# Altium schematic sheet RAM_DDR3_D16bit_BGA96.SchDoc
size A3
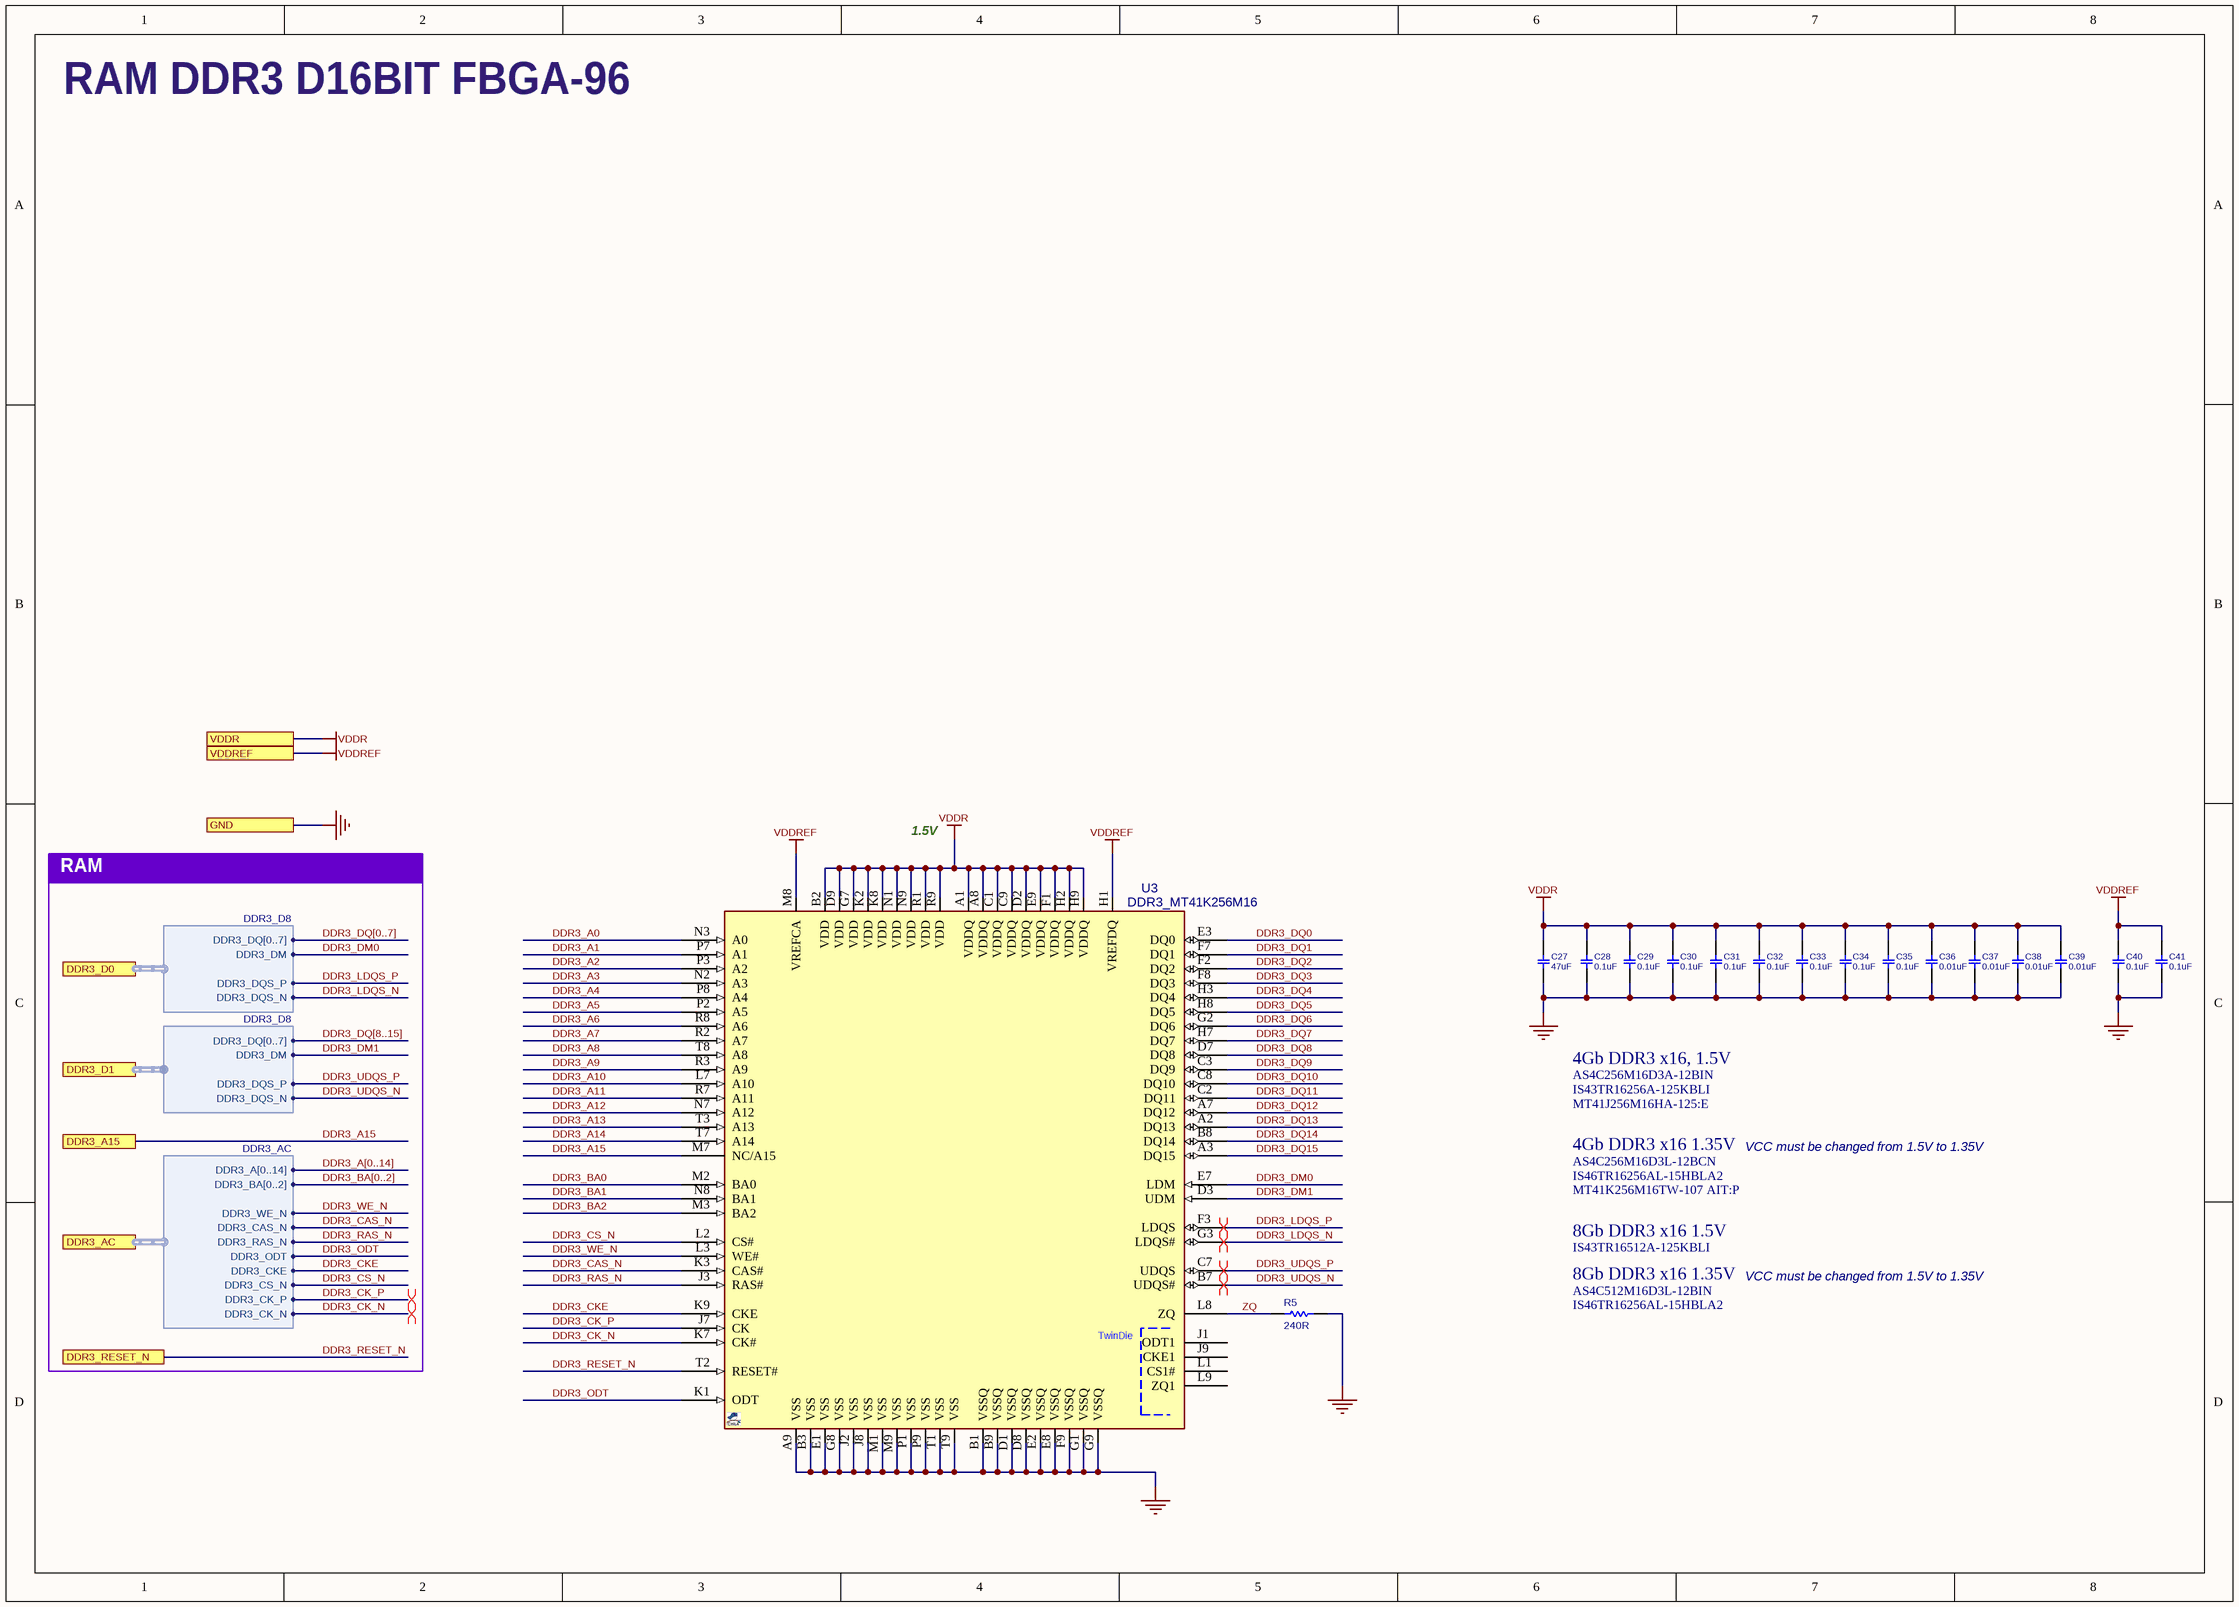
[diagram p0: RAM_DDR3_D16bit_BGA96.SchDoc]

## Parts
C27  47uF  [C0805]
C28  0.1uF  [C0402A]
C29  0.1uF  [C0402A]
C30  0.1uF  [C0402A]
C31  0.1uF  [C0402A]
C32  0.1uF  [C0402A]
C33  0.1uF  [C0402A]
C34  0.1uF  [C0402A]
C35  0.1uF  [C0402A]
C36  0.01uF  [C0402A]
C37  0.01uF  [C0402A]
C38  0.01uF  [C0402A]
C39  0.01uF  [C0402A]
C40  0.1uF  [C0402A]
C41  0.1uF  [C0402A]
R5  240R  [R0402A]
U3  DDR3_MT41K256M16  [BGA80_96_9X16B]

## Ports
DDR3_A15, DDR3_AC (harness DDR3_AC), DDR3_D0 (harness DDR3_D8), DDR3_D1 (harness DDR3_D8), DDR3_RESET_N, GND, VDDR, VDDREF

## Harnesses
DDR3_D8: DDR3_DQ[0..7], DDR3_DM, DDR3_DQS_P, DDR3_DQS_N
DDR3_AC: DDR3_A[0..14], DDR3_BA[0..2], DDR3_WE_N, DDR3_CAS_N, DDR3_RAS_N, DDR3_ODT, DDR3_CKE, DDR3_CS_N, DDR3_CK_P, DDR3_CK_N

## Nets
GND: C27.1 C28.1 C29.1 C30.1 C31.1 C32.1 C33.1 C34.1 C35.1 C36.1 C37.1 C38.1 C39.1 C40.1 C41.1 R5.2 U3.A9(VSS) U3.B1(VSSQ) U3.B3(VSS) U3.B9(VSSQ) U3.D1(VSSQ) U3.D8(VSSQ) U3.E1(VSS) U3.E2(VSSQ) U3.E8(VSSQ) U3.F9(VSSQ) U3.G1(VSSQ) U3.G8(VSS) U3.G9(VSSQ) U3.J2(VSS) U3.J8(VSS) U3.M1(VSS) U3.M9(VSS) U3.P1(VSS) U3.P9(VSS) U3.T1(VSS) U3.T9(VSS) ; port GND
VDDR: C27.2 C28.2 C29.2 C30.2 C31.2 C32.2 C33.2 C34.2 C35.2 C36.2 C37.2 C38.2 C39.2 U3.A1(VDDQ) U3.A8(VDDQ) U3.B2(VDD) U3.C1(VDDQ) U3.C9(VDDQ) U3.D2(VDDQ) U3.D9(VDD) U3.E9(VDDQ) U3.F1(VDDQ) U3.G7(VDD) U3.H2(VDDQ) U3.H9(VDDQ) U3.K2(VDD) U3.K8(VDD) U3.N1(VDD) U3.N9(VDD) U3.R1(VDD) U3.R9(VDD) ; port VDDR
VDDREF: C40.2 C41.2 U3.H1(VREFDQ) U3.M8(VREFCA) ; port VDDREF
DDR3_A0: U3.N3(A0)
DDR3_A1: U3.P7(A1)
DDR3_A2: U3.P3(A2)
DDR3_A3: U3.N2(A3)
DDR3_A4: U3.P8(A4)
DDR3_A5: U3.P2(A5)
DDR3_A6: U3.R8(A6)
DDR3_A7: U3.R2(A7)
DDR3_A8: U3.T8(A8)
DDR3_A9: U3.R3(A9)
DDR3_A10: U3.L7(A10)
DDR3_A11: U3.R7(A11)
DDR3_A12: U3.N7(A12)
DDR3_A13: U3.T3(A13)
DDR3_A14: U3.T7(A14)
DDR3_A15: U3.M7(NC/A15) ; port DDR3_A15
DDR3_BA0: U3.M2(BA0)
DDR3_BA1: U3.N8(BA1)
DDR3_BA2: U3.M3(BA2)
DDR3_CAS_N: U3.K3(CAS#) ; port DDR3_AC.DDR3_CAS_N
DDR3_CK_N: U3.K7(CK#) ; port DDR3_AC.DDR3_CK_N
DDR3_CK_P: U3.J7(CK) ; port DDR3_AC.DDR3_CK_P
DDR3_CKE: U3.K9(CKE) ; port DDR3_AC.DDR3_CKE
DDR3_CS_N: U3.L2(CS#) ; port DDR3_AC.DDR3_CS_N
DDR3_DM0: U3.E7(LDM) ; port DDR3_D0.DDR3_DM
DDR3_DM1: U3.D3(UDM) ; port DDR3_D1.DDR3_DM
DDR3_DQ0: U3.E3(DQ0)
DDR3_DQ1: U3.F7(DQ1)
DDR3_DQ2: U3.F2(DQ2)
DDR3_DQ3: U3.F8(DQ3)
DDR3_DQ4: U3.H3(DQ4)
DDR3_DQ5: U3.H8(DQ5)
DDR3_DQ6: U3.G2(DQ6)
DDR3_DQ7: U3.H7(DQ7)
DDR3_DQ8: U3.D7(DQ8)
DDR3_DQ9: U3.C3(DQ9)
DDR3_DQ10: U3.C8(DQ10)
DDR3_DQ11: U3.C2(DQ11)
DDR3_DQ12: U3.A7(DQ12)
DDR3_DQ13: U3.A2(DQ13)
DDR3_DQ14: U3.B8(DQ14)
DDR3_DQ15: U3.A3(DQ15)
DDR3_LDQS_N: U3.G3(LDQS#) ; port DDR3_D0.DDR3_DQS_N
DDR3_LDQS_P: U3.F3(LDQS) ; port DDR3_D0.DDR3_DQS_P
DDR3_ODT: U3.K1(ODT) ; port DDR3_AC.DDR3_ODT
DDR3_RAS_N: U3.J3(RAS#) ; port DDR3_AC.DDR3_RAS_N
DDR3_RESET_N: U3.T2(RESET#) ; port DDR3_RESET_N
DDR3_UDQS_N: U3.B7(UDQS#) ; port DDR3_D1.DDR3_DQS_N
DDR3_UDQS_P: U3.C7(UDQS) ; port DDR3_D1.DDR3_DQS_P
DDR3_WE_N: U3.L3(WE#) ; port DDR3_AC.DDR3_WE_N
ZQ: R5.1 U3.L8(ZQ)

Not connected (* = marked no-connect by the designer): U3 J1(ODT1) J9(CKE1) L1(CS1#) L9(ZQ1)

## Buses and harness runs
bus DDR3_A[0..14] = 
bus DDR3_BA[0..2] = 
bus DDR3_DQ[0..7]
bus DDR3_DQ[8..15]

## Layout directives
differential pair: DDR3_CK_N, DDR3_CK_P, DDR3_LDQS_N, DDR3_LDQS_P, DDR3_UDQS_N, DDR3_UDQS_P

## Notes on the sheet
- RAM DDR3 D16BIT FBGA-96
- 1.5V
- RAM
- 4Gb DDR3 x16, 1.5V
- MT41J256M16HA-125:E
- IS43TR16256A-125KBLI
- AS4C256M16D3A-12BIN
- AS4C256M16D3L-12BCN
- IS46TR16256AL-15HBLA2
- 4Gb DDR3 x16 1.35V
- MT41K256M16TW-107 AIT:P
- VCC must be changed from 1.5V to 1.35V
- 8Gb DDR3 x16 1.5V
- IS43TR16512A-125KBLI
- 8Gb DDR3 x16 1.35V
- AS4C512M16D3L-12BIN
- Title
- Size:
- Date:
- File:
- A1
- Number:
- Time:
- Revision:
- Sheet
- of
- (in symbol DDR3L_MT41K256M16_BGA96) TwinDie

## Library data of the parts
C27 = CAP_SMD_MLCC_47u16V: CAP, MLCC, X5R 47uF 16V 10% 1210; MANF: Murata; PARAM2: X5R, 10%; MANF_P#: GRM32ER61C476KE15K; PARAM: 16V; PRICE: 100= 47$; VALUE: 47uF
C28-C35 C40 C41 = CAP_SMD_MLCC_100n50T: CAP, MLCC, 100nF, 50V, X7R, 10%, 0402C; MANF: Taiyo Yuden; MANF_P#: UMK105B7104KVHF; PARAM: 50V; DESC: CAP, MLCC, 100nF, 50V, X7R, 10%, 0402C; PARAM2: X7R, 10%; ASSEMBLY: ASSEMBLY; VALUE: 0.1uF; PRICE: 100= 5$
C36-C39 = CAP_SMD_MLCC_10n50V: CAP, MLCC, 10nF, 50V, X7R, 10%, 0402C; MANF: Murata; MANF_P#: GCM155R71H103KA55D; DIST#: MOUSER/81-GCM155R71H103KA5D; PARAM: 50V; PARAM2: X7R, 10%; DESC: CAP, MLCC, 10nF, 50V, X7R, 10%, 0402C; VALUE: 0.01uF; ASSEMBLY: ASSEMBLY; PRICE: 100= 0.8$
R5 = Res1: Resistor; Published: 8-Jun-2000; LatestRevisionDate: 17-Jul-2002; LatestRevisionNote: Re-released for DXP Platform.; PackageReference: AXIAL-0.3; Publisher: Altium Limited; PackageDescription: Axial Device, Thru-Hole; 2 Leads; 0.3 in Pin Spacing; Value: 240R
U3 = DDR3L_MT41K256M16_BGA96: DDR3L SDRAM, 4Gb (256Mb X16), 1.35V, FBGA-96; MANF_P#: MT41K256M16TW-107 AIT:P; MANF: MICRON; PARAM: 4Gb (256Mb X16), 933MHz; PARAM2: 1.35V, -40~95oC; ASSEMBLY: ASSEMBLY; PRICE: 16$; VALUE: DDR3_MT41K256M16